# EAGLE design Practicum_front (EAGLE 9.5.1)
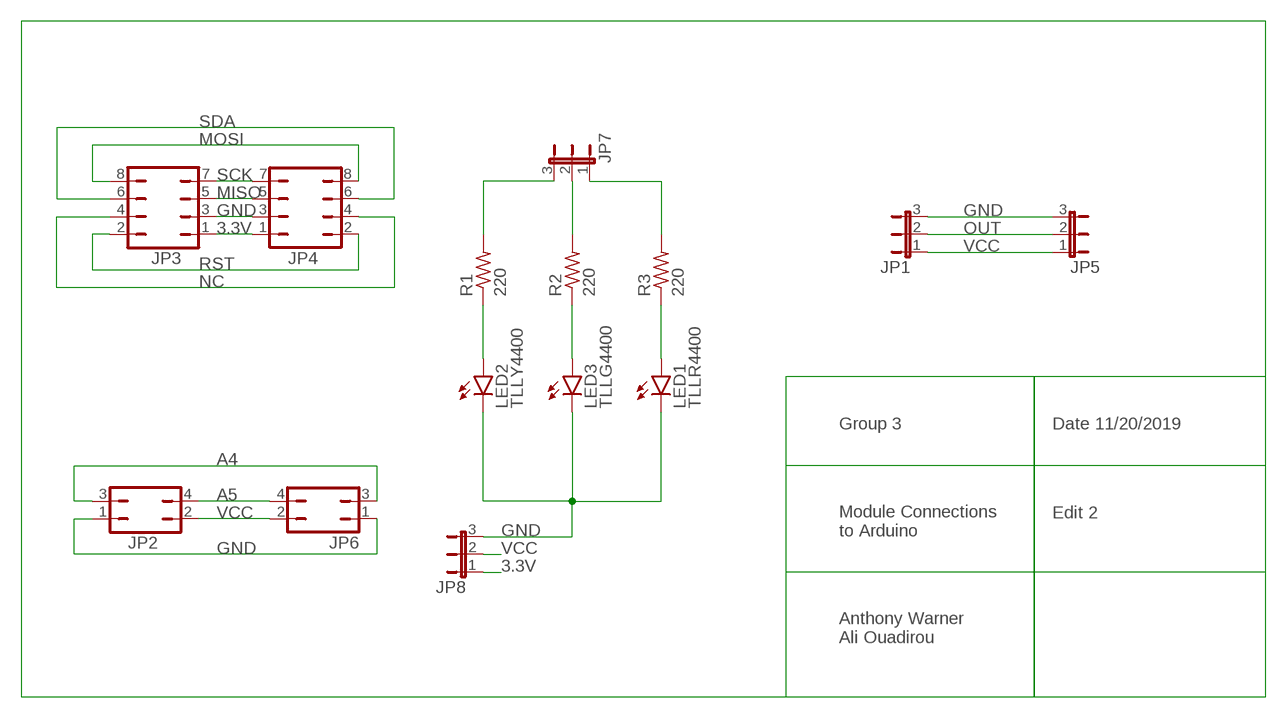
[diagram p0: schematic, sheet 1]

## Parts
JP1  0  JP2E  [JP2]
JP2  0  JP2Q  [JP2Q]
JP3  0  JP4Q  [JP4Q]
JP4  0  JP4Q  [JP4Q]
JP5  0  JP2E  [JP2]
JP6  0  JP2Q  [JP2Q]
JP7  0  JP2E  [JP2]
JP8  0  JP2E  [JP2]
LED1  TLLR4400  [LED3MM]
LED2  TLLY4400  [LED3MM]
LED3  TLLG4400  [LED3MM]
R1  220  R-US_M0805  [M0805]
R2  220  R-US_M0805  [M0805]
R3  220  R-US_M0805  [M0805]

## Nets
3.3V [3.3V]: JP3.1 JP4.1 JP8.1
A4: JP2.3 JP6.3
A5: JP2.4 JP6.4
GND [GND]: JP1.3 JP2.1 JP3.3 JP4.3 JP5.3 JP6.1 JP8.3 LED1.K(C) LED2.K(C) LED3.K(C)
MISO: JP3.5 JP4.5
MOSI: JP3.8 JP4.8
N$16: JP7.3 R1.2
N$18: JP7.2 R2.2
N$19: LED1.A R3.1
N$20: LED3.A R2.1
N$21: LED2.A R1.1
N$22: JP7.1 R3.2
NC: JP3.4 JP4.4
OUT: JP1.2 JP5.2
RST: JP3.2 JP4.2
SCK: JP3.7 JP4.7
SDA: JP3.6 JP4.6
VCC [VCC]: JP1.1 JP2.2 JP5.1 JP6.2 JP8.2

## Notes on the sheet
- Group 3 | Date 11/20/2019
- Edit 2
- Module Connections
  to Arduino
- Anthony Warner
  Ali Ouadirou

## Library data of the parts
JP1 JP5 JP7 JP8 = jumper:JP2E: JUMPER
JP2 JP6 = jumper:JP2Q: JUMPER
JP3 JP4 = jumper:JP4Q: JUMPER
LED1 = led:TLLR4400: Low Current (2mA) LED 3 mm Tinted Diffused Package color RED Source: Data sheet <http://www.farnell.com/datasheets/391100.pdf>; MF: VISHAY SEMICONDUCTOR; OC_FARNELL: 1612437
LED2 = led:TLLY4400: Low Current (2mA) LED 3 mm Tinted Diffused Package color YELLOW Source: Data sheet <http://www.farnell.com/datasheets/391098.pdf>; MF: VISHAY SEMICONDUCTOR; OC_FARNELL: 1612439
LED3 = led:TLLG4400: Low Current (2mA) LED 3 mm Tinted Diffused Package color GREEN Source: Data sheet <http://www.farnell.com/datasheets/391098.pdf>; MF: VISHAY SEMICONDUCTOR; OC_FARNELL: 1612435
R1-R3 = rcl:R-US_: RESISTOR, American symbol; SPICEPREFIX: R

## Net classes
0 default: width 1.016 mm, drill 0.152 mm
1 VCC: width 1.016 mm, drill 0.152 mm
2 GND: width 1.016 mm, drill 0.152 mm
3 3.3V: width 1.016 mm, drill 0.152 mm

## Board
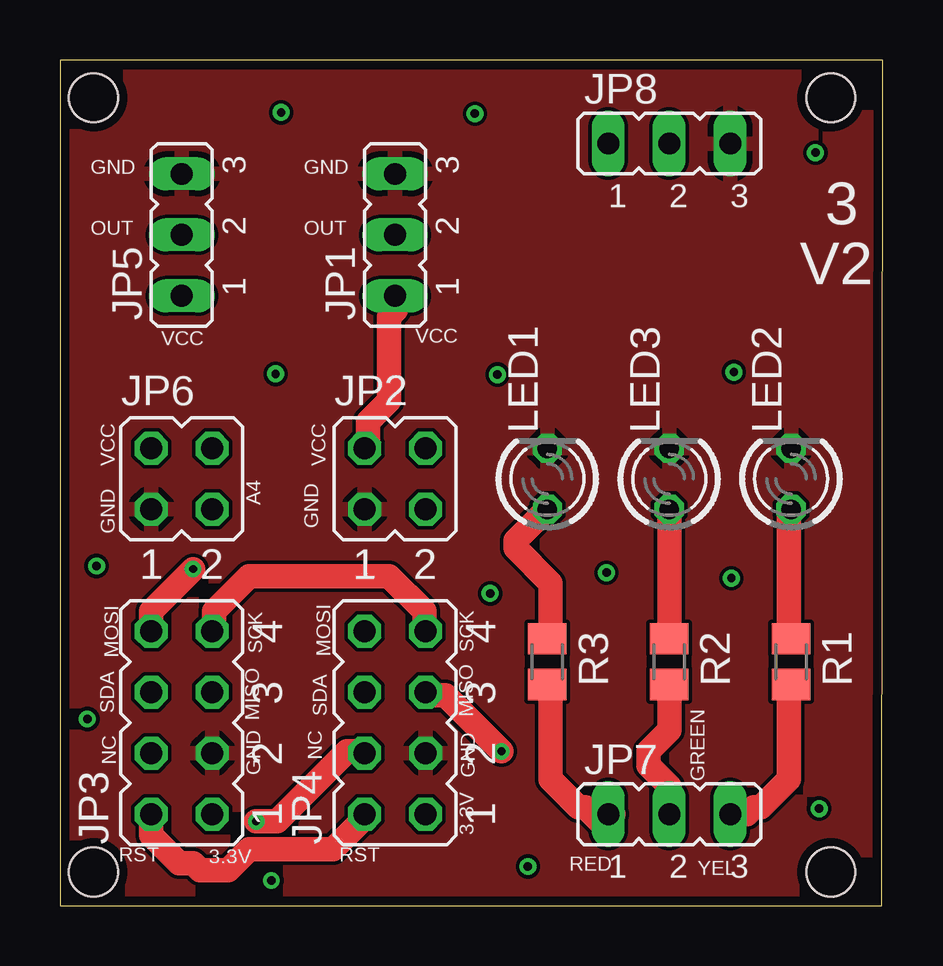
[diagram p1: board, top side]
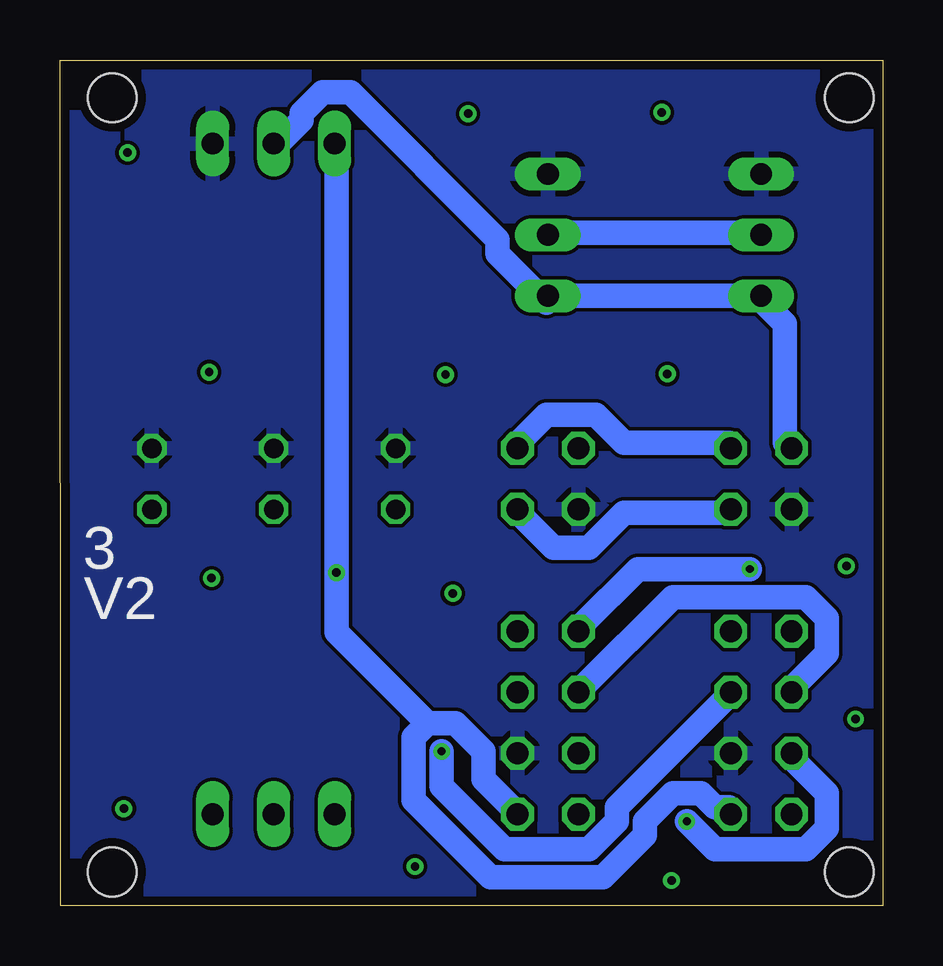
[diagram p2: board, bottom side, seen from below]

Size 34.31 x 35.23 mm. Coordinates in mm from the lower left corner, seen from the top.
Outline: 0,0 34.27,0 34.31,35.23 0,35.23 0,0
Copper layers (1*16): Top 0.0356mm / dielectric 1.5011mm / Bottom 0.0356mm
Design rules "LaenPCBOrder": minimum track width 6mil, minimum drill 13mil, track to track 6mil, track to pad 6mil, pad to pad 6mil, via to via 6mil, smd to smd 6mil, copper to edge 15mil, drill to drill 6mil, minimum pad ring 7mil, minimum via ring 7mil, stop-mask expansion 3mil, vias tented up to drill 0mil, thermal gap 10mil
Holes 2.03 mm at 1.4,33.66 32.13,33.66 32.13,1.4 1.4,1.4

### Footprints (pad centres in the part's own frame; a part is rotated, then mirrored left to right if it is on the bottom)
JP2 = drill 0.914 long: 1 -2.54,0; 2 0,0; 3 2.54,0
JP2Q = drill 0.914 octagon: 1 -1.27,-1.27; 2 -1.27,1.27; 3 1.27,-1.27; 4 1.27,1.27
JP4Q = drill 0.914 octagon: 1 -3.81,-1.27; 2 -3.81,1.27; 3 -1.27,-1.27; 4 -1.27,1.27; 5 1.27,-1.27; 6 1.27,1.27; 7 3.81,-1.27; 8 3.81,1.27
LED3MM = drill 0.813 octagon: A -1.27,0; K 1.27,0
M0805 = smd 1.3 x 1.6: 1 -0.95,0; 2 0.95,0

### Placement (x,y rotation side)
JP1  13.97,27.94 90 top
JP2  13.97,17.78 0 top
JP3  5.08,7.62 90 top
JP4  13.97,7.62 90 top
JP5  5.08,27.94 90 top
JP6  5.08,17.78 0 top
JP7  25.4,3.81 0 top
JP8  25.4,31.75 0 top
LED1  20.32,17.78 90 top
LED2  30.48,17.78 90 top
LED3  25.4,17.78 90 top
R1  30.48,10.16 270 top
R2  25.4,10.16 270 top
R3  20.32,10.16 270 top

### Tracks (layer width: path | path; a pad name or v marks a point on that pad's centre or on a via)
3.3V  (via drill 0.35)
  Bottom 1.016: 18.99,7.59 19.57,7.01 19.57,4.38 16.36,1.17 11.68,1.17 9.93,2.92 9.93,3.5 8.76,4.67 7.59,4.67 7.01,4.09 6.43,4.09 JP3.1 | 18.99,7.59 17.82,7.59 16.65,6.43 16.65,5.26 15.48,4.09 JP4.1 | 18.99,7.59 22.78,11.39 v22.78,13.87 22.78,31.55 JP8.1
A4
  Bottom 1.016: JP6.3 6.43,16.36 10.81,16.36 12.27,14.9 13.73,14.9 15.19,16.36 JP2.3
A5
  Bottom 1.016: JP6.4 6.43,19.28 10.81,19.28 11.98,20.45 14.02,20.45 15.19,19.28 JP2.4
GND
  pour Top: 0,35.56 0,0 34.29,0 34.29,35.56
  pour Bottom: 0.08,35 0.08,0.23 34.06,0.23 34.06,35
MISO  (via drill 0.33)
  Top 1.016: v18.4,6.43 16.07,8.76 15.48,8.76 JP4.5
  Bottom 1.016: v18.4,6.43 18.4,4.97 15.77,2.34 12.27,2.34 11.1,3.5 11.1,4.09 6.43,8.76 JP3.5
MOSI  (via drill 0.33)
  Top 1.016: v5.55,14.02 3.8,12.27 3.8,11.68 JP3.8
  Bottom 1.016: v5.55,14.02 10.22,14.02 12.56,11.68 JP4.8
N$1  (via drill 0.35)
  other vias: 9.22,33.05
N$2  (via drill 0.35)
  other vias: 17.3,32.99
N$3  (via drill 0.35)
  other vias: 31.5,31.37
N$4  (via drill 0.35)
  other vias: 28.09,22.23
N$5  (via drill 0.35)
  other vias: 18.24,22.12
N$6  (via drill 0.35)
  other vias: 17.93,13
N$7  (via drill 0.35)
  other vias: 31.65,4.04
N$8  (via drill 0.35)
  other vias: 19.51,1.63
N$9  (via drill 0.35)
  other vias: 8.81,1.04
N$10  (via drill 0.35)
  other vias: 1.14,7.77
N$11  (via drill 0.35)
  other vias: 1.52,14.15
N$12  (via drill 0.35)
  other vias: 27.99,13.64
N$13  (via drill 0.35)
  other vias: 8.99,22.15
N$16
  Top 1.016: R1.2 30.38,9.05 30.38,5.26 29.21,4.09 28.92,4.09 28.63,3.8 28.04,3.8 JP7.3
N$18
  Top 1.016: R2.2 25.41,9.05 25.41,7.3 24.54,6.43 24.54,5.84 25.41,4.97 25.41,4.09 JP7.2
N$19
  Top 1.016: R3.1 20.45,11.39 20.45,13.44 18.99,14.9 18.99,15.19 20.16,16.36 LED1.A
N$20
  Top 1.016: R2.1 25.41,11.39 25.41,16.36 LED3.A
N$21
  Top 1.016: R1.1 30.38,11.39 30.38,16.36 LED2.A
N$22
  Top 1.016: R3.2 20.45,9.05 20.45,5.26 21.61,4.09 21.91,4.09 22.49,3.5 22.78,3.5 23.08,3.8 JP7.1
NC  (via drill 0.33)
  Top 1.016: v8.18,3.5 9.05,3.5 11.98,6.43 12.56,6.43 JP4.4
  Bottom 1.016: v8.18,3.5 7.01,2.34 3.21,2.34 2.34,3.21 2.34,4.67 3.8,6.13 JP3.4
OUT
  Bottom 1.016: JP5.2 5.26,28.04 13.73,28.04 JP1.2
RST
  Top 1.016: JP3.2 3.8,3.8 3.8,2.92 4.97,1.75 5.55,1.75 5.84,1.46 7.01,1.46 7.89,2.34 11.39,2.34 12.85,3.8 JP4.2
SCK
  Top 1.016: JP3.7 6.43,11.68 6.43,12.27 7.89,13.73 13.73,13.73 15.19,12.27 15.19,11.68 JP4.7
SDA
  Bottom 1.016: JP3.6 3.8,9.05 2.34,10.52 2.34,11.98 3.21,12.85 8.76,12.85 12.56,9.05 JP4.6
VCC
  Top 1.016: JP2.2 12.85,19.28 12.85,20.16 13.73,21.03 13.73,24.54 14.02,24.83 14.02,25.12 JP1.1
  Bottom 1.016: JP6.2 4.09,19.28 4.09,24.24 4.97,25.12 JP5.1 5.55,25.41 13.73,25.41 JP1.1 14.02,25.12 16.07,27.16 16.07,27.75 22.2,33.88 23.37,33.88 24.24,33.01 24.24,32.72 25.12,31.84 JP8.2

### Text on the board
tPlace: 3 | V2
bPlace: 3 | V2
tNames: GND | GND | OUT | OUT | VCC | VCC | VCC | VCC | A4 | GND | GND | MOSI | MOSI | SCK | SCK | SDA | MISO | SDA | MISO | NC | NC | GND | GND | GREEN | 3.3V | RST | 3.3V | RST | RED | YEL